# EAGLE schematic 5v-esp8266-switch-sensor (EAGLE 7.1.0)
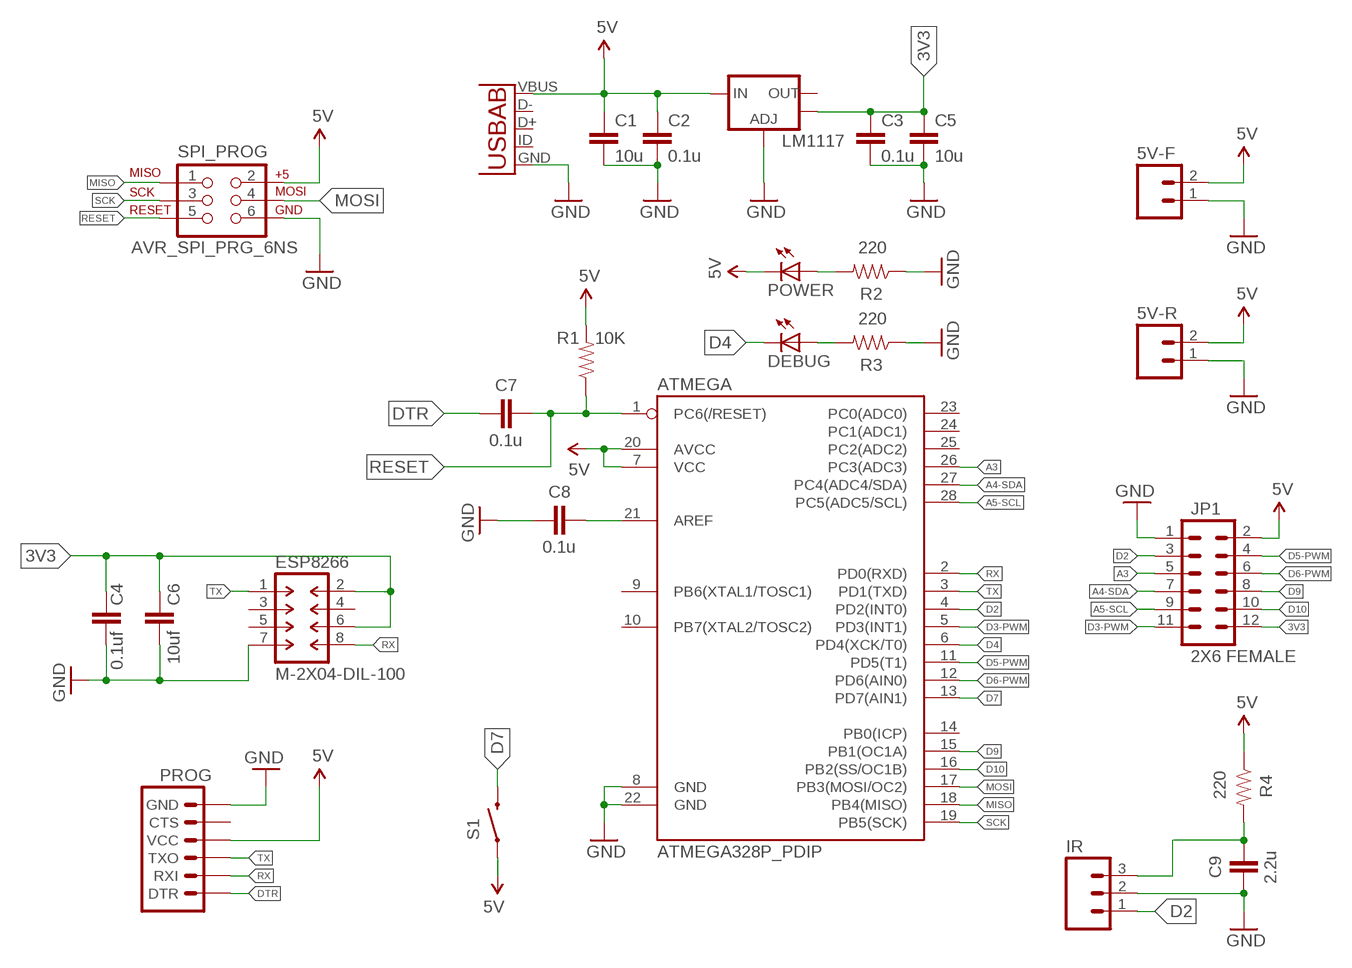
[diagram p0: schematic, sheet 1]

## Parts
5V-F  M02PTH  [1X02]
5V-R  M02PTH  [1X02]
ATMEGA  ATMEGA328P_PDIP  [DIL28-3]
C1  10u  CAP0805  [0805]
C2  0.1u  CAP0805  [0805]
C3  0.1u  CAP0805  [0805]
C4  0.1uf  CAP0805  [0805]
C5  10u  CAP0805  [0805]
C6  10uf  CAP0805  [0805]
C7  0.1u  CAP0805  [0805]
C8  0.1u  CAP0805  [0805]
C9  2.2u  CAP0805  [0805]
DEBUG  LEDCHIPLED_0805  [CHIPLED_0805]
ESP8266  M-2X04-DIL-100  [DIL-100-2X04]
IR  M03PTH  [1X03]
JP1  2X6 FEMALE  M06X2PTH_FEMALE  [2X6]
LM1117  V_REG_LM1117SOT223  [SOT223]
POWER  LEDCHIPLED_0805  [CHIPLED_0805]
PROG  ARDUINO_SERIAL_PROGRAMPTH  [1X06]
R1  10K  RESISTOR0805-RES  [0805]
R2  220  RESISTOR0805-RES  [0805]
R3  220  RESISTOR0805-RES  [0805]
R4  220  RESISTOR0805-RES  [0805]
S1  SWITCH-MOMENTARY-2SMD-1101NE  [TACTILE-SWITCH-1101NE]
SPI_PROG  AVR_SPI_PRG_6NS  [2X3-NS]
U1  USB-AB  [USB-AB-MICRO-SMD]

## Nets
3V3: C3.1 C4.1 C5.1 C6.1 ESP8266.2 ESP8266.6 JP1.12 LM1117.4(OUT)
5V: 5V-F.2 5V-R.2 ATMEGA.7(VCC) ATMEGA.20(AVCC) C1.1 C2.1 JP1.2 LM1117.3(IN) POWER.C PROG.4(VCC) R1.2 R4.1 S1.1 SPI_PROG.2 U1.VBUS
A3: ATMEGA.26(PC3(ADC3)) JP1.5
A4-SDA: ATMEGA.27(PC4(ADC4/SDA)) JP1.7
A5-SCL: ATMEGA.28(PC5(ADC5/SCL)) JP1.9
D2: ATMEGA.4(PD2(INT0)) IR.1 JP1.3
D3-PWM: ATMEGA.5(PD3(INT1)) JP1.11
D4: ATMEGA.6(PD4(XCK/T0)) DEBUG.C
D5-PWM: ATMEGA.11(PD5(T1)) JP1.4
D6-PWM: ATMEGA.12(PD6(AIN0)) JP1.6
D7: ATMEGA.13(PD7(AIN1)) S1.2
D9: ATMEGA.15(PB1(OC1A)) JP1.8
D10: ATMEGA.16(PB2(SS/OC1B)) JP1.10
DTR: C7.1 PROG.1(DTR)
GND: 5V-F.1 5V-R.1 ATMEGA.8(GND) ATMEGA.22(GND) C1.2 C2.2 C3.2 C4.2 C5.2 C6.2 C8.1 C9.1 ESP8266.7 IR.2 JP1.1 LM1117.1(ADJ) PROG.6(GND) R2.1 R3.1 SPI_PROG.6 U1.GND
MISO: ATMEGA.18(PB4(MISO)) SPI_PROG.1
MOSI: ATMEGA.17(PB3(MOSI/OC2)) SPI_PROG.4
N$1: C9.2 IR.3 R4.2
N$2: POWER.A R2.2
N$3: ATMEGA.21(AREF) C8.2
N$4: DEBUG.A R3.2
RESET: ATMEGA.1(PC6(/RESET)) C7.2 R1.1 SPI_PROG.5
RX: ATMEGA.2(PD0(RXD)) ESP8266.8 PROG.2(RXI)
SCK: ATMEGA.19(PB5(SCK)) SPI_PROG.3
TX: ATMEGA.3(PD1(TXD)) ESP8266.1 PROG.3(TXO)
Unconnected: ATMEGA.9(PB6(XTAL1/TOSC1)) ATMEGA.10(PB7(XTAL2/TOSC2)) ATMEGA.14(PB0(ICP)) ATMEGA.23(PC0(ADC0)) ATMEGA.24(PC1(ADC1)) ATMEGA.25(PC2(ADC2)) ESP8266.3 ESP8266.4 ESP8266.5 LM1117.2(OUT) PROG.5(CTS) U1.D+ U1.D- U1.ID(USBID)

## Library data of the parts
5V-F 5V-R = SparkFun-Connectors:M02: Standard 2-pin 0.1" header. Use with - straight break away headers ( PRT-00116) - right angle break away headers (PRT-00553) - swiss pins (PRT-00743) - machine pins (PRT-00117) - female headers (PRT-00115) Molex polarized connector foot print use with: PRT-08233 with associated crimp pins and housings. 2.54_SCREWTERM for use with PRT-10571. 3.5mm Screw Terminal footprints for PRT-08084 5mm Screw Terminal footprints for use with PRT-08432
ATMEGA = SparkFun-DigitalIC:ATMEGA328P_PDIP: uC used in the Arduino 32kb flash, 1k EEPROM, 2k SRAM This is the through-hole version of this chip.
C1-C9 = SparkFun-Capacitors:CAP: Capacitor Standard 0603 ceramic capacitor, and 0.1" leaded capacitor.
DEBUG POWER = adafruit:LED: LED OSRAM: - CHIPLED LG R971, LG N971, LY N971, LG Q971, LY Q971, LO R971, LY R971 LH N974, LH R974 LS Q976, LO Q976, LY Q976 LO Q996 - Hyper CHIPLED LW Q18S LB Q993, LB Q99A, LB R99A - SideLED LS A670, LO A670, LY A670, LG A670, LP A670 LB A673, LV A673, LT A673, LW A673 LH A674 LY A675 LS A676, LA A676, LO A676, LY A676, LW A676 LS A679, LY A679, LG A679 - Hyper Micro SIDELED® LS Y876, LA Y876, LO Y876, LY Y876 LT Y87S - SmartLED LW L88C, LW L88S LB L89C, LB L89S, LG L890 LS L89K, LO L89K, LY L89K LS L896, LA L896, LO L896, LY L896 - TOPLED LS T670, LO T670, LY T670, LG T670, LP T670 LSG T670, LSP T670, LSY T670, LOP T670, LYG T670 LG T671, LOG T671, LSG T671 LB T673, LV T673, LT T673, LW T673 LH T674 LS T676, LA T676, LO T676, LY T676, LB T676, LH T676, LSB T676, LW T676 LB T67C, LV T67C, LT T67C, LS T67K, LO T67K, LY T67K, LW E67C LS E67B, LA E67B, LO E67B, LY E67B, LB E67C, LV E67C, LT E67C LW T67C LS T679, LY T679, LG T679 LS T770, LO T770, LY T770, LG T770, LP T770 LB T773, LV T773, LT T773, LW T773 LH T774 LS E675, LA E675, LY E675, LS T675 LS T776, LA T776, LO T776, LY T776, LB T776 LHGB T686 LT T68C, LB T68C - Hyper Mini TOPLED® LB M676 - Mini TOPLED Santana® LG M470 LS M47K, LO M47K, LY M47K Source: http://www.osram.convergy.de/
ESP8266 = con-headers-jp:M-2X04-: MALE HEADER
IR = SparkFun-Connectors:M03: Header 3 Standard 3-pin 0.1" header. Use with straight break away headers (SKU : PRT-00116), right angle break away headers (PRT-00553), swiss pins (PRT-00743), machine pins (PRT-00117), and female headers (PRT-00115). Molex polarized connector foot print use with SKU : PRT-08232 with associated crimp pins and housings.
JP1 = SparkFun-Connectors:M06X2; PROD_ID: CONN-12423
LM1117 = SparkFun-PowerIC:V_REG_LM1117: Voltage Regulator LM1117 Standard adjustable voltage regulator but in SMD form. Spark Fun Electronics SKU : COM-00595; PROD_ID: VREG-08170
PROG = SparkFun-Connectors:ARDUINO_SERIAL_PROGRAM: FTDI connector footprints
R1-R4 = SparkFun-Resistors:RESISTOR: Resistor Basic schematic elements and footprints for 0603, 1206, and PTH resistors.
S1 = SparkFun-Electromechanical:SWITCH-MOMENTARY-2: Various NO switches- pushbuttons, reed, etc; PROD_ID: SWCH-00815
SPI_PROG = SparkFun-Connectors:AVR_SPI_PRG_6: AVR ISP 6 Pin This is the reduced ISP connector for AVR programming. Common on Arduino. This footprint will take up less PCB space and can be used with a 10-pin to 6-pin adapter such as SKU: BOB-08508 **Special note about "TEST_POINT" package. The stop mask is on the top side, so if you want your programming test points to be on the bottom of your board, make sure to place this package on the bottom side of the board. This also ensure that the orientation to program from the bottom side will be correct.
U1 = SparkFun-Connectors:USB-AB: This is a USB AB connector that is compatible with USB OTG. i.e. this connector can serve as a host or device